# EAGLE design clock (EAGLE 7.5.0)
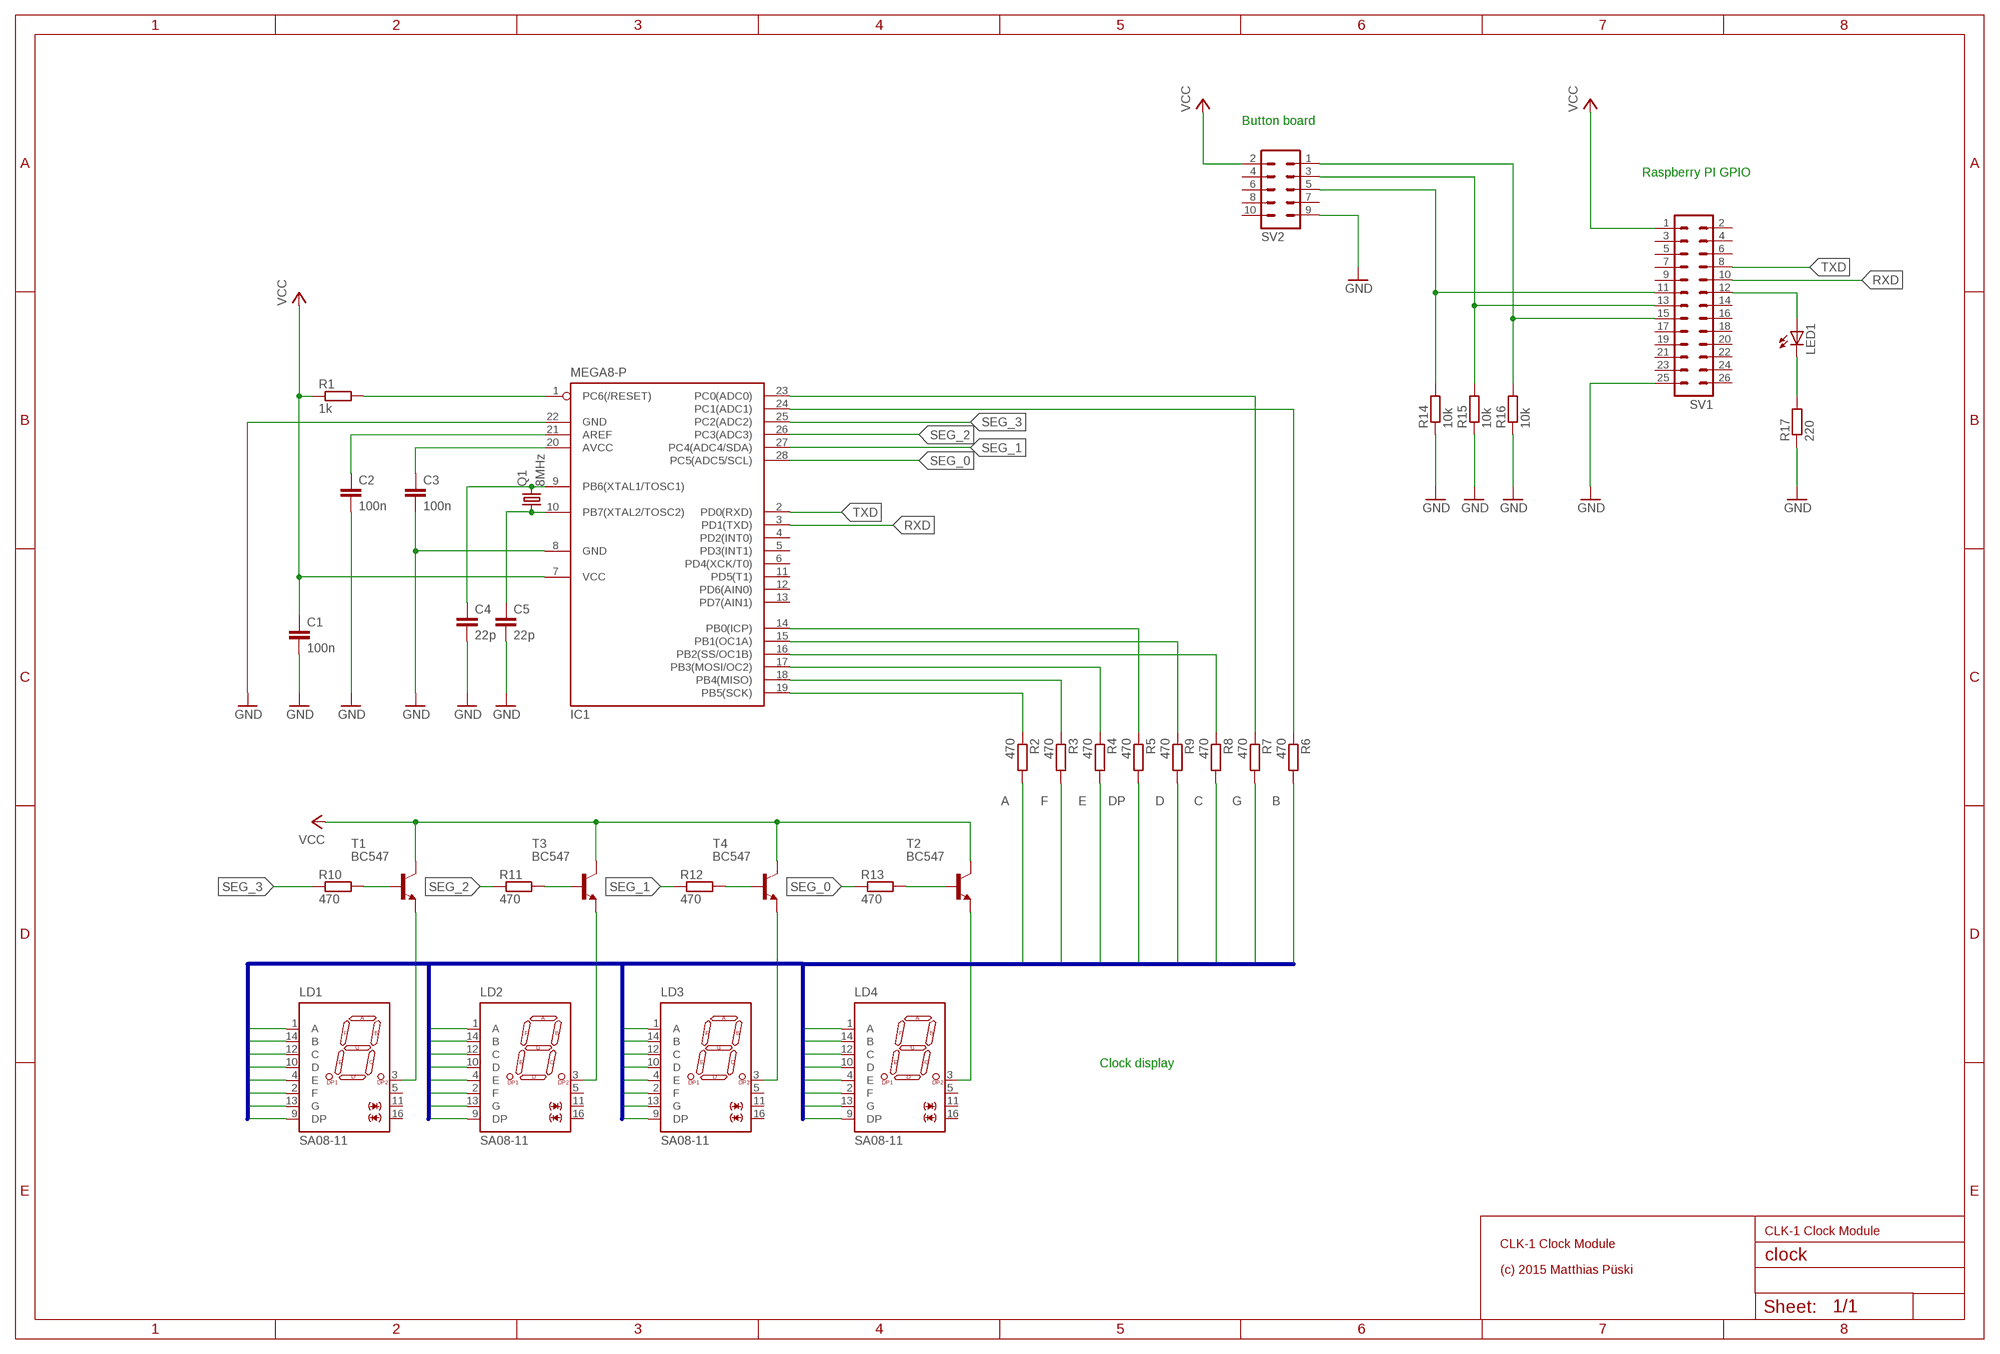
[diagram p0: schematic, sheet 1]

## Parts
C1  100n  C-EU025-024X044  [C025-024X044]
C2  100n  C-EU025-024X044  [C025-024X044]
C3  100n  C-EU025-024X044  [C025-024X044]
C4  22p  C-EU025-024X044  [C025-024X044]
C5  22p  C-EU025-024X044  [C025-024X044]
IC1  MEGA8-P  [DIL28-3]
LD1  SA08-11  [SA08]
LD2  SA08-11  [SA08]
LD3  SA08-11  [SA08]
LD4  SA08-11  [SA08]
LED1  LED5MM  [LED5MM]
Q1  8MHz  CRYSTALHC49S  [HC49/S]
R1  1k  R-EU_0207/10  [0207/10]
R2  470  R-EU_0207/10  [0207/10]
R3  470  R-EU_0207/10  [0207/10]
R4  470  R-EU_0207/10  [0207/10]
R5  470  R-EU_0207/10  [0207/10]
R6  470  R-EU_0207/10  [0207/10]
R7  470  R-EU_0207/10  [0207/10]
R8  470  R-EU_0207/10  [0207/10]
R9  470  R-EU_0207/10  [0207/10]
R10  470  R-EU_0207/10  [0207/10]
R11  470  R-EU_0207/10  [0207/10]
R12  470  R-EU_0207/10  [0207/10]
R13  470  R-EU_0207/10  [0207/10]
R14  10k  R-EU_0207/10  [0207/10]
R15  10k  R-EU_0207/10  [0207/10]
R16  10k  R-EU_0207/10  [0207/10]
R17  220  R-EU_0207/10  [0207/10]
SV1  ML26L  [ML26L]
SV2  ML10L  [ML10L]
T1  BC547  [TO92]
T2  BC547  [TO92]
T3  BC547  [TO92]
T4  BC547  [TO92]

## Nets
A: LD1.1(A) LD2.1(A) LD3.1(A) LD4.1(A) R2.2
B: LD1.14(B) LD2.14(B) LD3.14(B) LD4.14(B) R6.2
C: LD1.12(C) LD2.12(C) LD3.12(C) LD4.12(C) R8.2
D: LD1.10(D) LD2.10(D) LD3.10(D) LD4.10(D) R9.2
DP: LD1.9(DP) LD2.9(DP) LD3.9(DP) LD4.9(DP) R5.2
E: LD1.4(E) LD2.4(E) LD3.4(E) LD4.4(E) R4.2
F: LD1.2(F) LD2.2(F) LD3.2(F) LD4.2(F) R3.2
G: LD1.13(G) LD2.13(G) LD3.13(G) LD4.13(G) R7.2
GND: C1.2 C2.2 C3.2 C4.2 C5.2 IC1.8(GND) IC1.22(GND) R14.1 R15.1 R16.1 R17.1 SV1.25 SV2.9
N$1: IC1.14(PB0(ICP)) R5.1
N$2: IC1.18(PB4(MISO)) R3.1
N$3: IC1.17(PB3(MOSI/OC2)) R4.1
N$4: IC1.19(PB5(SCK)) R2.1
N$5: IC1.15(PB1(OC1A)) R9.1
N$6: IC1.16(PB2(SS/OC1B)) R8.1
N$7: IC1.23(PC0(ADC0)) R7.1
N$8: IC1.24(PC1(ADC1)) R6.1
N$9: LD1.3(AK) T1.1(E)
N$10: LD2.3(AK) T3.1(E)
N$11: LD3.3(AK) T4.1(E)
N$12: LD4.3(AK) T2.1(E)
N$13: R10.2 T1.2(B)
N$14: R11.2 T3.2(B)
N$15: R12.2 T4.2(B)
N$16: R13.2 T2.2(B)
N$17: R14.2 SV1.11 SV2.5
N$18: R15.2 SV1.13 SV2.3
N$19: R16.2 SV1.15 SV2.1
N$20: LED1.A SV1.12
N$21: IC1.1(PC6(/RESET)) R1.2
N$22: LED1.K(C) R17.2
N$23: C2.1 IC1.21(AREF)
N$24: C3.1 IC1.20(AVCC)
N$29: C4.1 IC1.9(PB6(XTAL1/TOSC1)) Q1.2
N$30: C5.1 IC1.10(PB7(XTAL2/TOSC2)) Q1.1
RXD: IC1.3(PD1(TXD)) SV1.10
SEG_0: IC1.28(PC5(ADC5/SCL)) R13.1
SEG_1: IC1.27(PC4(ADC4/SDA)) R12.1
SEG_2: IC1.26(PC3(ADC3)) R11.1
SEG_3: IC1.25(PC2(ADC2)) R10.1
TXD: IC1.2(PD0(RXD)) SV1.8
VCC: C1.1 IC1.7(VCC) R1.1 SV1.1 SV2.2 T1.3(C) T2.3(C) T3.3(C) T4.3(C)
Unconnected: IC1.4(PD2(INT0)) IC1.5(PD3(INT1)) IC1.6(PD4(XCK/T0)) IC1.11(PD5(T1)) IC1.12(PD6(AIN0)) IC1.13(PD7(AIN1)) LD1.5(AK) LD1.11(AK) LD1.16(AK) LD2.5(AK) LD2.11(AK) LD2.16(AK) LD3.5(AK) LD3.11(AK) LD3.16(AK) LD4.5(AK) LD4.11(AK) LD4.16(AK) SV1.2 SV1.3 SV1.4 SV1.5 SV1.6 SV1.7 SV1.9 SV1.14 SV1.16 SV1.17 SV1.18 SV1.19 SV1.20 SV1.21 SV1.22 SV1.23 SV1.24 SV1.26 SV2.4 SV2.6 SV2.7 SV2.8 SV2.10

## Buses
A,B,C,D,E,F,G,DP

## Notes on the sheet
- Button board
- Raspberry PI GPIO
- Clock display
- CLK-1 Clock Module
- CLK-1 Clock Module
- (c) 2015 Matthias Püski

## Library data of the parts
C1-C5 = rcl:C-EU: CAPACITOR, European symbol
IC1 = atmel:MEGA8-P: MICROCONTROLLER 8 Kbytes FLASH, 1 kbytes SRAM, 512 bytes EEPROM, USART, 4-channel 10 bit ADC, 2-channel 8 bit ADC Pin compatible with Atmega48, ATMega88, ATMega168 Source: avr.lbr; OC_FARNELL: unknown; OC_NEWARK: unknown
LD1-LD4 = led:S*08: Kingbright 20mm (0.8Inch) Single Digit Numeric Display Source: SA08-11SRWA.pdf
LED1 = led:LED: LED OSRAM: - CHIPLED LG R971, LG N971, LY N971, LG Q971, LY Q971, LO R971, LY R971 LH N974, LH R974 LS Q976, LO Q976, LY Q976 LO Q996 - Hyper CHIPLED LW Q18S LB Q993, LB Q99A, LB R99A - SideLED LS A670, LO A670, LY A670, LG A670, LP A670 LB A673, LV A673, LT A673, LW A673 LH A674 LY A675 LS A676, LA A676, LO A676, LY A676, LW A676 LS A679, LY A679, LG A679 - Hyper Micro SIDELED® LS Y876, LA Y876, LO Y876, LY Y876 LT Y87S - SmartLED LW L88C, LW L88S LB L89C, LB L89S, LG L890 LS L89K, LO L89K, LY L89K LS L896, LA L896, LO L896, LY L896 - TOPLED LS T670, LO T670, LY T670, LG T670, LP T670 LSG T670, LSP T670, LSY T670, LOP T670, LYG T670 LG T671, LOG T671, LSG T671 LB T673, LV T673, LT T673, LW T673 LH T674 LS T676, LA T676, LO T676, LY T676, LB T676, LH T676, LSB T676, LW T676 LB T67C, LV T67C, LT T67C, LS T67K, LO T67K, LY T67K, LW E67C LS E67B, LA E67B, LO E67B, LY E67B, LB E67C, LV E67C, LT E67C LW T67C LS T679, LY T679, LG T679 LS T770, LO T770, LY T770, LG T770, LP T770 LB T773, LV T773, LT T773, LW T773 LH T774 LS E675, LA E675, LY E675, LS T675 LS T776, LA T776, LO T776, LY T776, LB T776 LHGB T686 LT T68C, LB T68C - Hyper Mini TOPLED® LB M676 - Mini TOPLED Santana® LG M470 LS M47K, LO M47K, LY M47K Source: http://www.osram.convergy.de LUXEON: - LUMILED® LXK2-PW12-R00, LXK2-PW12-S00, LXK2-PW14-U00, LXK2-PW14-V00 LXK2-PM12-R00, LXK2-PM12-S00, LXK2-PM14-U00 LXK2-PE12-Q00, LXK2-PE12-R00, LXK2-PE12-S00, LXK2-PE14-T00, LXK2-PE14-U00 LXK2-PB12-K00, LXK2-PB12-L00, LXK2-PB12-M00, LXK2-PB14-N00, LXK2-PB14-P00, LXK2-PB14-Q00 LXK2-PR12-L00, LXK2-PR12-M00, LXK2-PR14-Q00, LXK2-PR14-R00 LXK2-PD12-Q00, LXK2-PD12-R00, LXK2-PD12-S00 LXK2-PH12-R00, LXK2-PH12-S00 LXK2-PL12-P00, LXK2-PL12-Q00, LXK2-PL12-R00 Source: www.luxeon.com KINGBRIGHT: KA-3528ASYC Source: www.kingbright.com
Q1 = crystal:CRYSTAL: CRYSTAL; OC_FARNELL: 1667008; OC_NEWARK: unknown
R1-R17 = resistor:R-EU_: RESISTOR, European symbol
SV1 = con-harting-ml:ML26: HARTING; OC_FARNELL: unknown; OC_NEWARK: unknown
SV2 = con-harting-ml:ML10: HARTING; OC_FARNELL: unknown; OC_NEWARK: unknown
T1-T4 = transistor:BC547: NPN TRANSISTOR

## Board
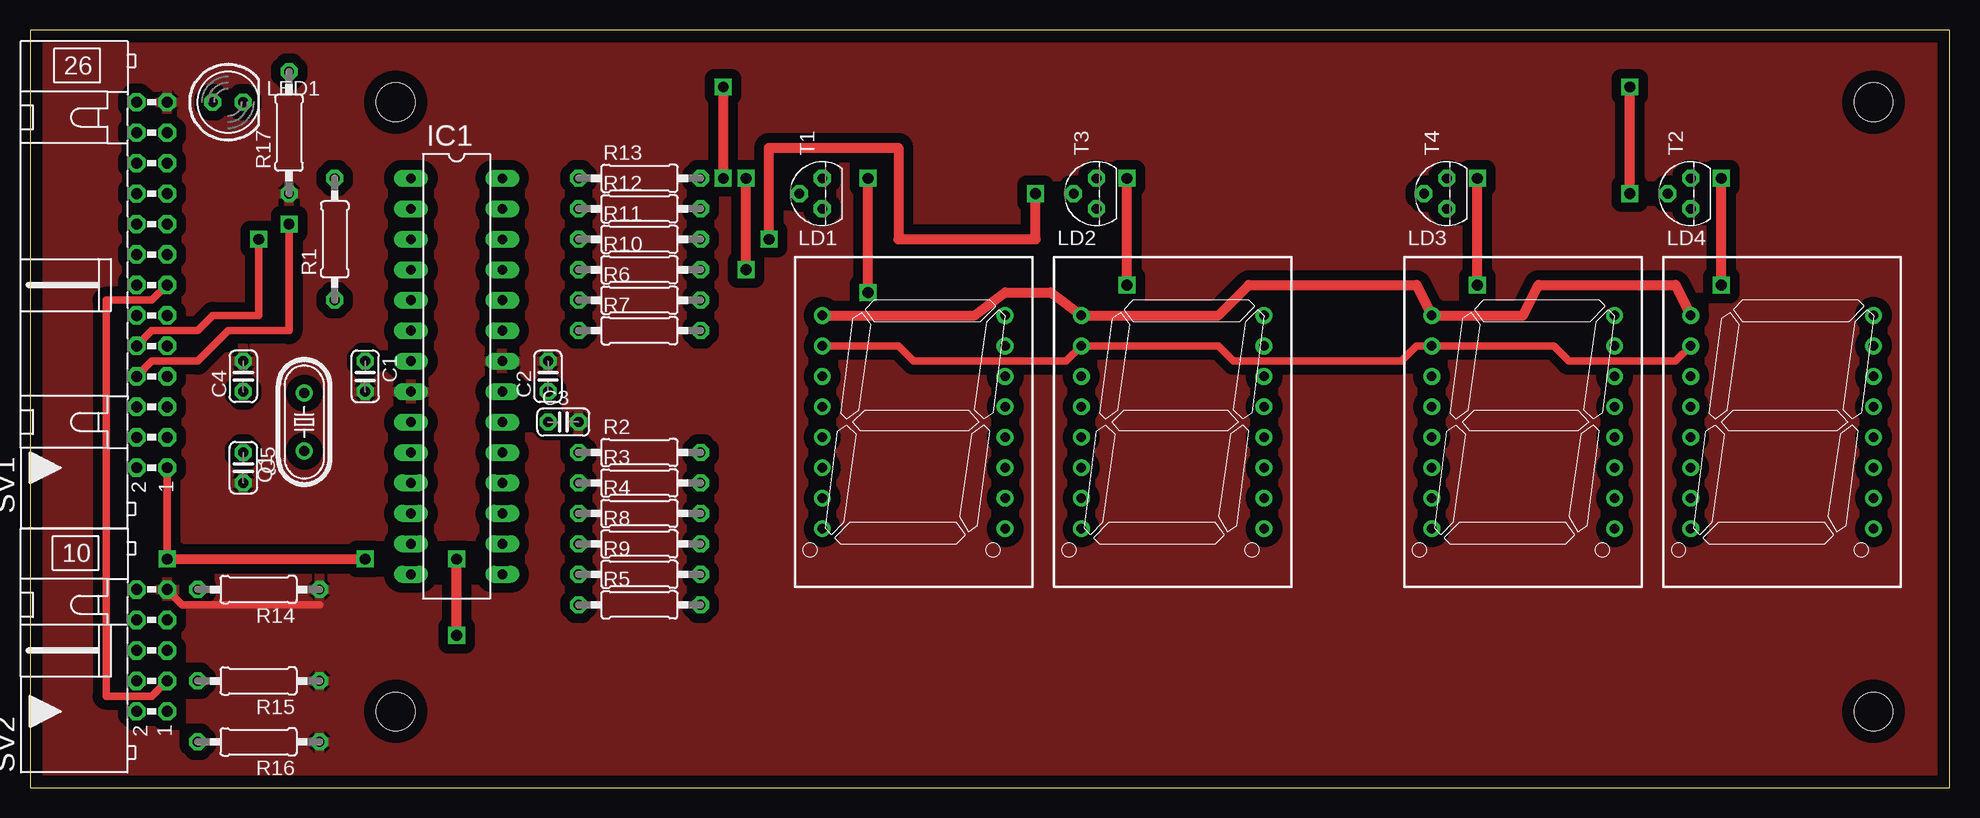
[diagram p1: board, top side]
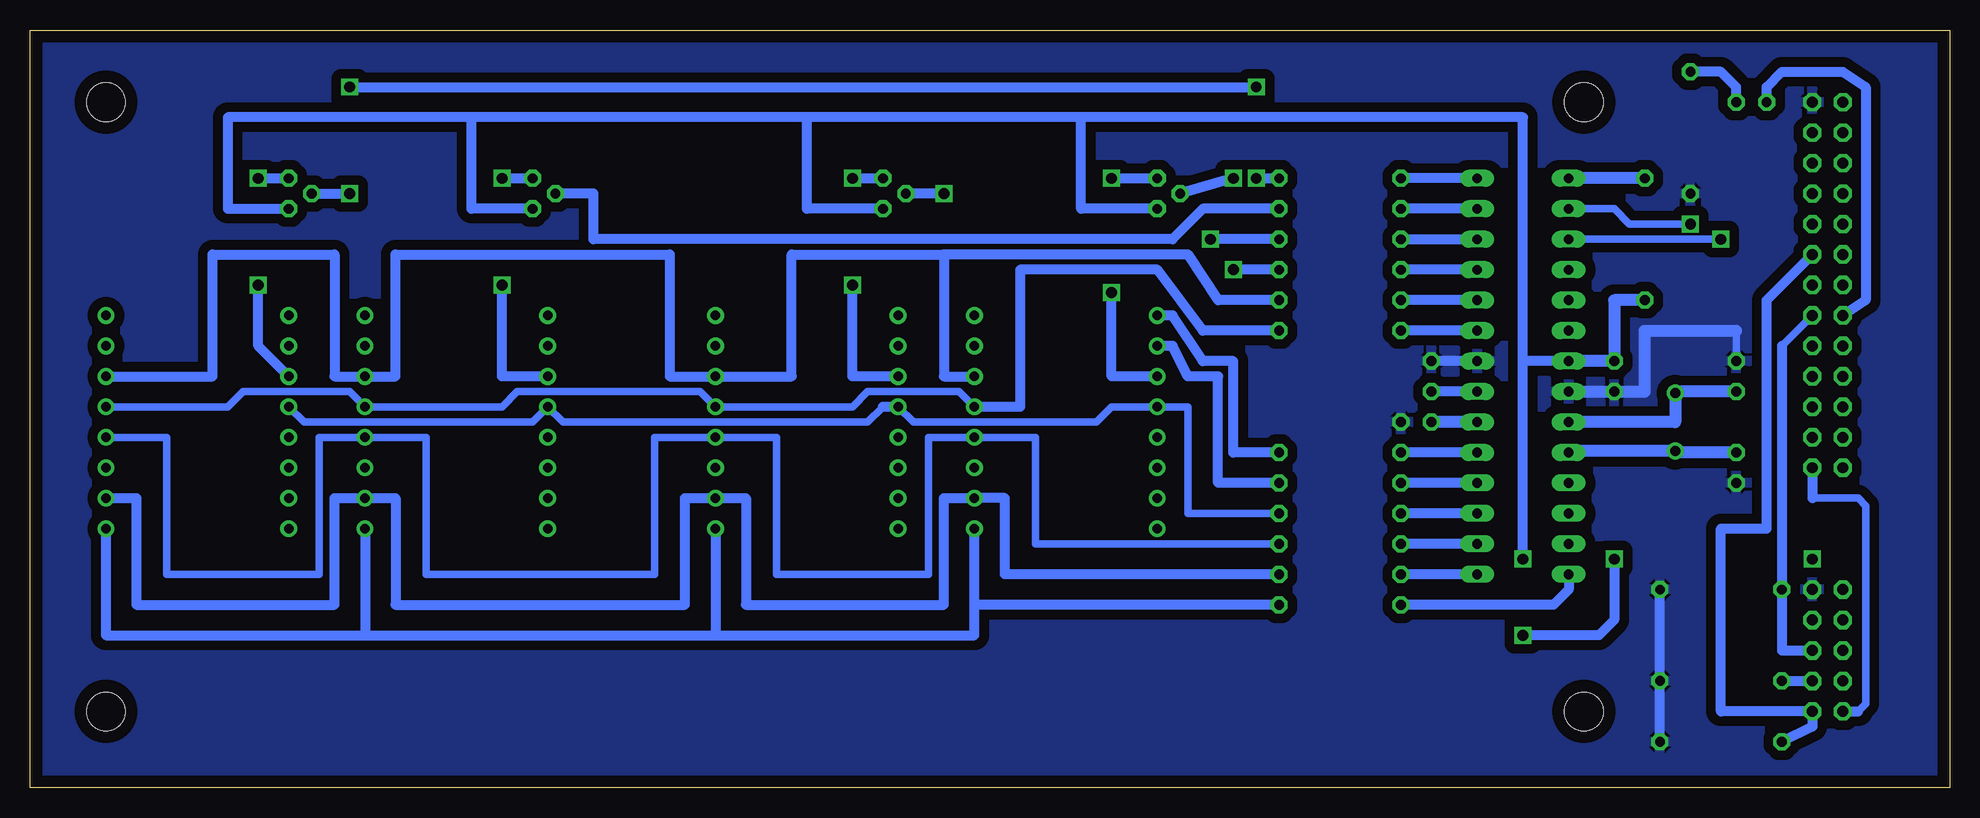
[diagram p2: board, bottom side, seen from below]

Size 160 x 63.17 mm. Coordinates in mm from the lower left corner, seen from the top.
Outline: 0,0 160,0 160,63.17 0,63.17 0,0
Copper layers (1*16): Top 0.035mm / dielectric 1.5mm / Bottom 0.035mm
Design rules "default *": minimum track width 10mil, minimum drill 24mil, track to track 8mil, track to pad 8mil, pad to pad 8mil, via to via 8mil, smd to smd 8mil, copper to edge 40mil, drill to drill 8mil, minimum pad ring 12mil, minimum via ring 10mil, stop-mask expansion 4mil, vias tented up to drill 0mil, thermal gap 10mil
Holes 3.2 mm at 153.67,57.15 153.67,6.35 30.48,6.35 30.48,57.15

### Footprints (pad centres in the part's own frame; a part is rotated, then mirrored left to right if it is on the bottom)
C025-024X044 = drill 0.813 octagon: 1 -1.27,0; 2 1.27,0
DIL28-3 = drill 0.813 long: 1 -16.51,-3.81; 2 -13.97,-3.81; 3 -11.43,-3.81; 4 -8.89,-3.81; 5 -6.35,-3.81; 6 -3.81,-3.81; 7 -1.27,-3.81; 8 1.27,-3.81; 9 3.81,-3.81; 10 6.35,-3.81; 11 8.89,-3.81; 12 11.43,-3.81; 13 13.97,-3.81; 14 16.51,-3.81; 15 16.51,3.81; 16 13.97,3.81; 17 11.43,3.81; 18 8.89,3.81; 19 6.35,3.81; 20 3.81,3.81; 21 1.27,3.81; 22 -1.27,3.81; 23 -3.81,3.81; 24 -6.35,3.81; 25 -8.89,3.81; 26 -11.43,3.81; 27 -13.97,3.81; 28 -16.51,3.81
SA08 = drill 0.8 pad 1.27: 1 -7.62,8.89; 2 -7.62,6.35; 3 -7.62,3.81; 4 -7.62,1.27; 5 -7.62,-1.27; 6 -7.62,-3.81; 7 -7.62,-6.35; 8 -7.62,-8.89; 9 7.62,-8.89; 10 7.62,-6.35; 11 7.62,-3.81; 12 7.62,-1.27; 13 7.62,1.27; 14 7.62,3.81; 15 7.62,6.35; 16 7.62,8.89
LED5MM = drill 0.813 octagon: A -1.27,0; K 1.27,0
HC49/S = drill 0.813: 1 -2.413,0; 2 2.413,0
0207/10 = drill 0.813 octagon: 1 -5.08,0; 2 5.08,0
ML26L = drill 0.914 octagon: 1 -15.24,-1.27; 2 -15.24,1.27; 3 -12.7,-1.27; 4 -12.7,1.27; 5 -10.16,-1.27; 6 -10.16,1.27; 7 -7.62,-1.27; 8 -7.62,1.27; 9 -5.08,-1.27; 10 -5.08,1.27; 11 -2.54,-1.27; 12 -2.54,1.27; 13 0,-1.27; 14 0,1.27; 15 2.54,-1.27; 16 2.54,1.27; 17 5.08,-1.27; 18 5.08,1.27; 19 7.62,-1.27; 20 7.62,1.27; 21 10.16,-1.27; 22 10.16,1.27; 23 12.7,-1.27; 24 12.7,1.27; 25 15.24,-1.27; 26 15.24,1.27
ML10L = drill 0.914 octagon: 1 -5.08,-1.27; 2 -5.08,1.27; 3 -2.54,-1.27; 4 -2.54,1.27; 5 0,-1.27; 6 0,1.27; 7 2.54,-1.27; 8 2.54,1.27; 9 5.08,-1.27; 10 5.08,1.27
TO92 = drill 0.813 octagon: 1 1.27,0; 2 0,1.905; 3 -1.27,0

### Placement (x,y rotation side)
C1  27.94,34.29 270 top
C2  43.18,34.29 90 top
C3  44.45,30.48 0 top
C4  17.78,34.29 90 top
C5  17.78,26.67 270 top
IC1  35.56,34.29 270 top
LD1  73.66,30.48 0 top
LD2  95.25,30.48 0 top
LD3  124.46,30.48 0 top
LD4  146.05,30.48 0 top
LED1  16.51,57.15 0 top
Q1  22.86,30.48 90 top
R1  25.4,45.72 90 top
R2  50.8,27.94 0 top
R3  50.8,25.4 0 top
R4  50.8,22.86 0 top
R5  50.8,15.24 0 top
R6  50.8,40.64 0 top
R7  50.8,38.1 0 top
R8  50.8,20.32 0 top
R9  50.8,17.78 0 top
R10  50.8,43.18 0 top
R11  50.8,45.72 0 top
R12  50.8,48.26 0 top
R13  50.8,50.8 0 top
R14  19.05,16.51 180 top
R15  19.05,8.89 180 top
R16  19.05,3.81 180 top
R17  21.59,54.61 90 top
SV1  10.16,41.91 90 top
SV2  10.16,11.43 90 top
T1  66.04,49.53 90 top
T2  138.43,49.53 90 top
T3  88.9,49.53 90 top
T4  118.11,49.53 90 top

### Tracks (layer width: path | path; a pad name or v marks a point on that pad's centre or on a via)
A
  Top 0.813: LD1.1 78.74,39.37 81.28,41.27 85.09,41.27 LD2.1 99.06,39.37 101.6,41.91 115.57,41.91 LD3.1 124.46,39.37 125.73,41.91 137.16,41.91 LD4.1
  Bottom 0.813: R2.2 59.69,27.94 59.69,35.56 62.23,35.56 64.77,39.37 LD1.1
B
  Bottom 0.813: LD4.14 144.78,34.29 144.78,44.45 134.62,44.45 134.62,34.29 LD3.14 129.54,34.29 129.54,44.45 106.68,44.45 106.68,34.29 LD2.14 96.52,34.29 96.52,44.45 83.82,44.45 | 83.82,44.45 83.82,34.29 LD1.14 | R6.2 60.96,40.64 63.5,44.45 83.82,44.45
C
  Bottom 0.61: LD4.12 148.59,29.21 148.59,17.78 135.89,17.78 135.89,29.21 LD3.12 127,29.21 127,17.78 107.95,17.78 107.95,29.21 LD2.12 97.79,29.21 97.79,17.78 85.09,17.78 85.09,29.21 LD1.12 76.2,29.21 76.2,20.32 R8.2
D
  Bottom 0.813: LD4.10 151.13,24.13 151.13,15.24 134.62,15.24 134.62,24.13 LD3.10 129.54,24.13 129.54,15.24 105.41,15.24 105.41,24.13 LD2.10 100.33,24.13 100.33,15.24 83.82,15.24 83.82,24.13 LD1.10 78.74,24.13 78.74,17.78 R9.2
DP
  Bottom 0.813: LD4.9 153.67,12.7 132.08,12.7 | 132.08,12.7 102.87,12.7 | 102.87,12.7 81.28,12.7 81.28,15.24 | 81.28,15.24 LD1.9 | LD3.9 132.08,12.7 | LD2.9 102.87,12.7 | R5.2 81.28,15.24
E
  Bottom 0.61: R4.2 63.5,22.86 63.5,31.75 LD1.4 69.85,31.75 71.12,30.48 86.36,30.48 LD2.4 | 88.9,31.75 90.17,30.48 115.57,30.48 LD3.4 118.11,30.48 137.16,30.48 LD4.4
  Bottom 0.813: LD2.4 88.9,31.75
F
  Top 0.61: LD1.2 72.39,36.83 73.66,35.56 86.36,35.56 LD2.2 99.06,36.83 100.33,35.56 114.3,35.56 115.57,36.83 LD3.2 127,36.83 128.27,35.56 137.16,35.56 LD4.2
  Bottom 0.813: R3.2 60.96,25.4 60.96,34.29 63.5,34.29 64.77,36.83 LD1.2
G
  Bottom 0.61: LD4.13 143.51,31.75 142.24,33.02 133.35,33.02 LD3.13 120.65,31.75 119.38,33.02 104.14,33.02 LD2.13 91.44,31.75 90.17,33.02 82.55,33.02 LD1.13
  Bottom 0.813: R7.2 62.23,38.1 66.04,43.18 77.47,43.18 77.47,31.75 LD1.13
GND
  Top 0.61: SV2.9 12.7,15.24 24.13,15.24
  Bottom 0.61: 17.78,38.1 C4.2
  Bottom 0.813: IC1.22 C2.2 | R16.1 R15.1 R14.1
  Bottom 1.016: IC1.8 C1.2 25.4,33.02 25.4,38.1 17.78,38.1
  pour Bottom (isolate 0.813): 1.27,1.27 158.75,1.27 158.75,62.23 1.27,62.23
  pour Top (isolate 0.813): 1.27,1.27 158.75,1.27 158.75,62.23 1.27,62.23
N$1
  Bottom 0.813: IC1.14 31.75,16.51 33.02,15.24 R5.1
N$2
  Bottom 0.813: IC1.18 R3.1
N$3
  Bottom 0.813: IC1.17 R4.1
N$4
  Bottom 0.813: IC1.19 R2.1
N$5
  Bottom 0.813: IC1.15 R9.1
N$6
  Bottom 0.813: IC1.16 R8.1
N$7
  Bottom 0.813: IC1.23 R7.1
N$8
  Bottom 0.813: IC1.24 R6.1
N$9  (via drill 0.9)
  Top 0.813: v69.85,41.27 v69.85,50.8
  Bottom 0.813: LD1.3 69.85,34.29 v69.85,41.27 | v69.85,50.8 T1.1
N$10  (via drill 0.9)
  Top 0.813: v91.44,41.91 v91.44,50.8
  Bottom 0.813: v91.44,50.8 T3.1 | LD2.3 91.44,34.29 v91.44,41.91
N$11  (via drill 0.9)
  Top 0.813: v120.65,41.91 v120.65,50.8
  Bottom 0.813: LD3.3 120.65,34.29 v120.65,41.91 | v120.65,50.8 T4.1
N$12  (via drill 0.9)
  Top 0.813: v140.97,41.91 v140.97,50.8
  Bottom 0.813: LD4.3 140.97,36.83 v140.97,41.91 | v140.97,50.8 T2.1
N$13  (via drill 0.9)
  Top 0.813: v59.69,43.18 v59.69,50.8
  Bottom 0.813: R10.2 v59.69,43.18 | v59.69,50.8 T1.2
N$14  (via drill 0.9)
  Top 0.813: v61.59,45.72 61.59,53.34 72.39,53.34 72.39,45.72 83.82,45.72 v83.82,49.53
  Bottom 0.813: R11.2 v61.59,45.72 | v83.82,49.53 T3.2
N$15
  Bottom 0.813: R12.2 62.23,48.26 64.77,45.72 113.03,45.72 113.03,49.53 T4.2
N$16  (via drill 0.9)
  Top 0.813: v133.35,49.53 v133.35,58.42 | v57.78,58.42 v57.78,50.8
  Bottom 0.813: T2.2 v133.35,49.53 | v133.35,58.42 v57.78,58.42 | v57.78,50.8 R13.2
N$17
  Bottom 0.61: SV1.11 13.97,36.83
  Bottom 0.813: SV2.5 13.97,11.43 R14.2 13.97,36.83
N$18
  Top 0.61: SV1.13 10.16,40.64 6.35,40.64 6.35,7.62 10.16,7.62 SV2.3
  Bottom 0.813: R15.2 SV2.3
N$19
  Bottom 0.813: R16.2 11.43,5.08 SV2.1 19.05,6.35 19.05,21.59 15.24,21.59 15.24,40.64 SV1.15
N$20
  Bottom 0.813: LED1.A 15.24,58.42 13.97,59.69 8.89,59.69 6.99,58.42 6.99,40.64 SV1.12
N$21
  Bottom 1.016: R1.2 IC1.1
N$22
  Bottom 0.813: LED1.K 17.78,58.42 19.05,59.69 R17.2
N$23
  Bottom 0.813: IC1.21 C2.1
N$24
  Bottom 1.016: IC1.20 C3.1
N$29
  Bottom 1.016: C4.1 22.86,33.02 Q1.2 22.86,30.48 IC1.9
N$30
  Bottom 1.016: C5.1 22.86,27.94 Q1.1 31.75,28.07 IC1.10
RXD  (via drill 0.9)
  Top 0.61: SV1.10 10.16,38.1 13.97,38.1 15.24,39.37 19.05,39.37 v19.05,45.72
  Bottom 0.61: v19.05,45.72 IC1.3
SEG_0
  Bottom 0.813: IC1.28 R13.1
SEG_1
  Bottom 0.813: IC1.27 R12.1
SEG_2
  Bottom 0.813: R11.1 IC1.26
SEG_3
  Bottom 0.813: IC1.25 R10.1
TXD  (via drill 0.9)
  Top 0.61: v21.59,46.99 21.59,38.1 16.51,38.1 13.97,35.56 10.16,35.56 SV1.8
  Bottom 0.61: IC1.2 27.94,48.26 26.67,46.99 v21.59,46.99
VCC  (via drill 0.9)
  Top 0.61: v11.43,19.05 SV1.1
  Top 0.813: v11.43,19.05 v27.94,19.05 | v35.56,12.7 v35.56,19.05
  Bottom 0.61: 7.62,6.35 6.99,6.99 6.99,23.5 7.62,24.13 11.43,24.13
  Bottom 0.813: SV2.2 7.62,6.35 | IC1.7 35.56,35.56 | 35.56,35.56 35.56,55.88 72.39,55.88 | 72.39,55.88 95.25,55.88 | 95.25,55.88 123.19,55.88 | 123.19,55.88 143.51,55.88 143.51,48.26 T2.3 | T4.3 123.19,48.26 123.19,55.88 | T3.3 95.25,48.26 95.25,55.88 | T1.3 72.39,48.26 72.39,55.88 | SV1.1 11.43,24.13 | v27.94,19.05 27.94,13.97 29.21,12.7 v35.56,12.7 | v35.56,19.05 35.56,35.56
  Bottom 1.016: IC1.7 C1.1 27.94,40.64 R1.1